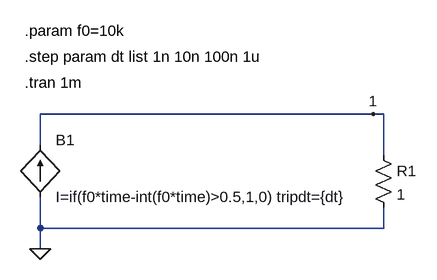
[diagram p0: schematic B_tripdt.asc]
B_tripdt.asc, the LTspice schematic file:
Version 4
SHEET 1 880 680
WIRE 496 160 -16 160
WIRE 512 160 496 160
WIRE -16 208 -16 160
WIRE 512 224 512 160
WIRE -16 336 -16 288
WIRE 512 336 512 304
WIRE 512 336 -16 336
WIRE -16 368 -16 336
FLAG -16 368 0
FLAG 496 160 1
SYMBOL bi -16 288 M180
WINDOW 0 24 88 Left 0
WINDOW 3 24 0 Left 0
SYMATTR InstName B1
SYMATTR Value I=if(f0*time-int(f0*time)>0.5,1,0) tripdt={dt}
SYMBOL res 496 208 R0
SYMATTR InstName R1
SYMATTR Value 1
TEXT -40 112 Left 0 !.tran 1m
TEXT -40 72 Left 0 !.step param dt list 1n 10n 100n 1u
TEXT -40 32 Left 0 !.param f0=10k

The netlist it stands for:
* B_tripdt.asc
B1 0 1 I=if(f0*time-int(f0*time)>0.5,1,0) tripdt={dt}
R1 1 0 1
.tran 1m
.step param dt list 1n 10n 100n 1u
.param f0=10k
.backanno
.end